# Altium schematic sheet F103-DRV8313.SchDoc
size A3; SheetNumber: 1; SheetTotal: 1
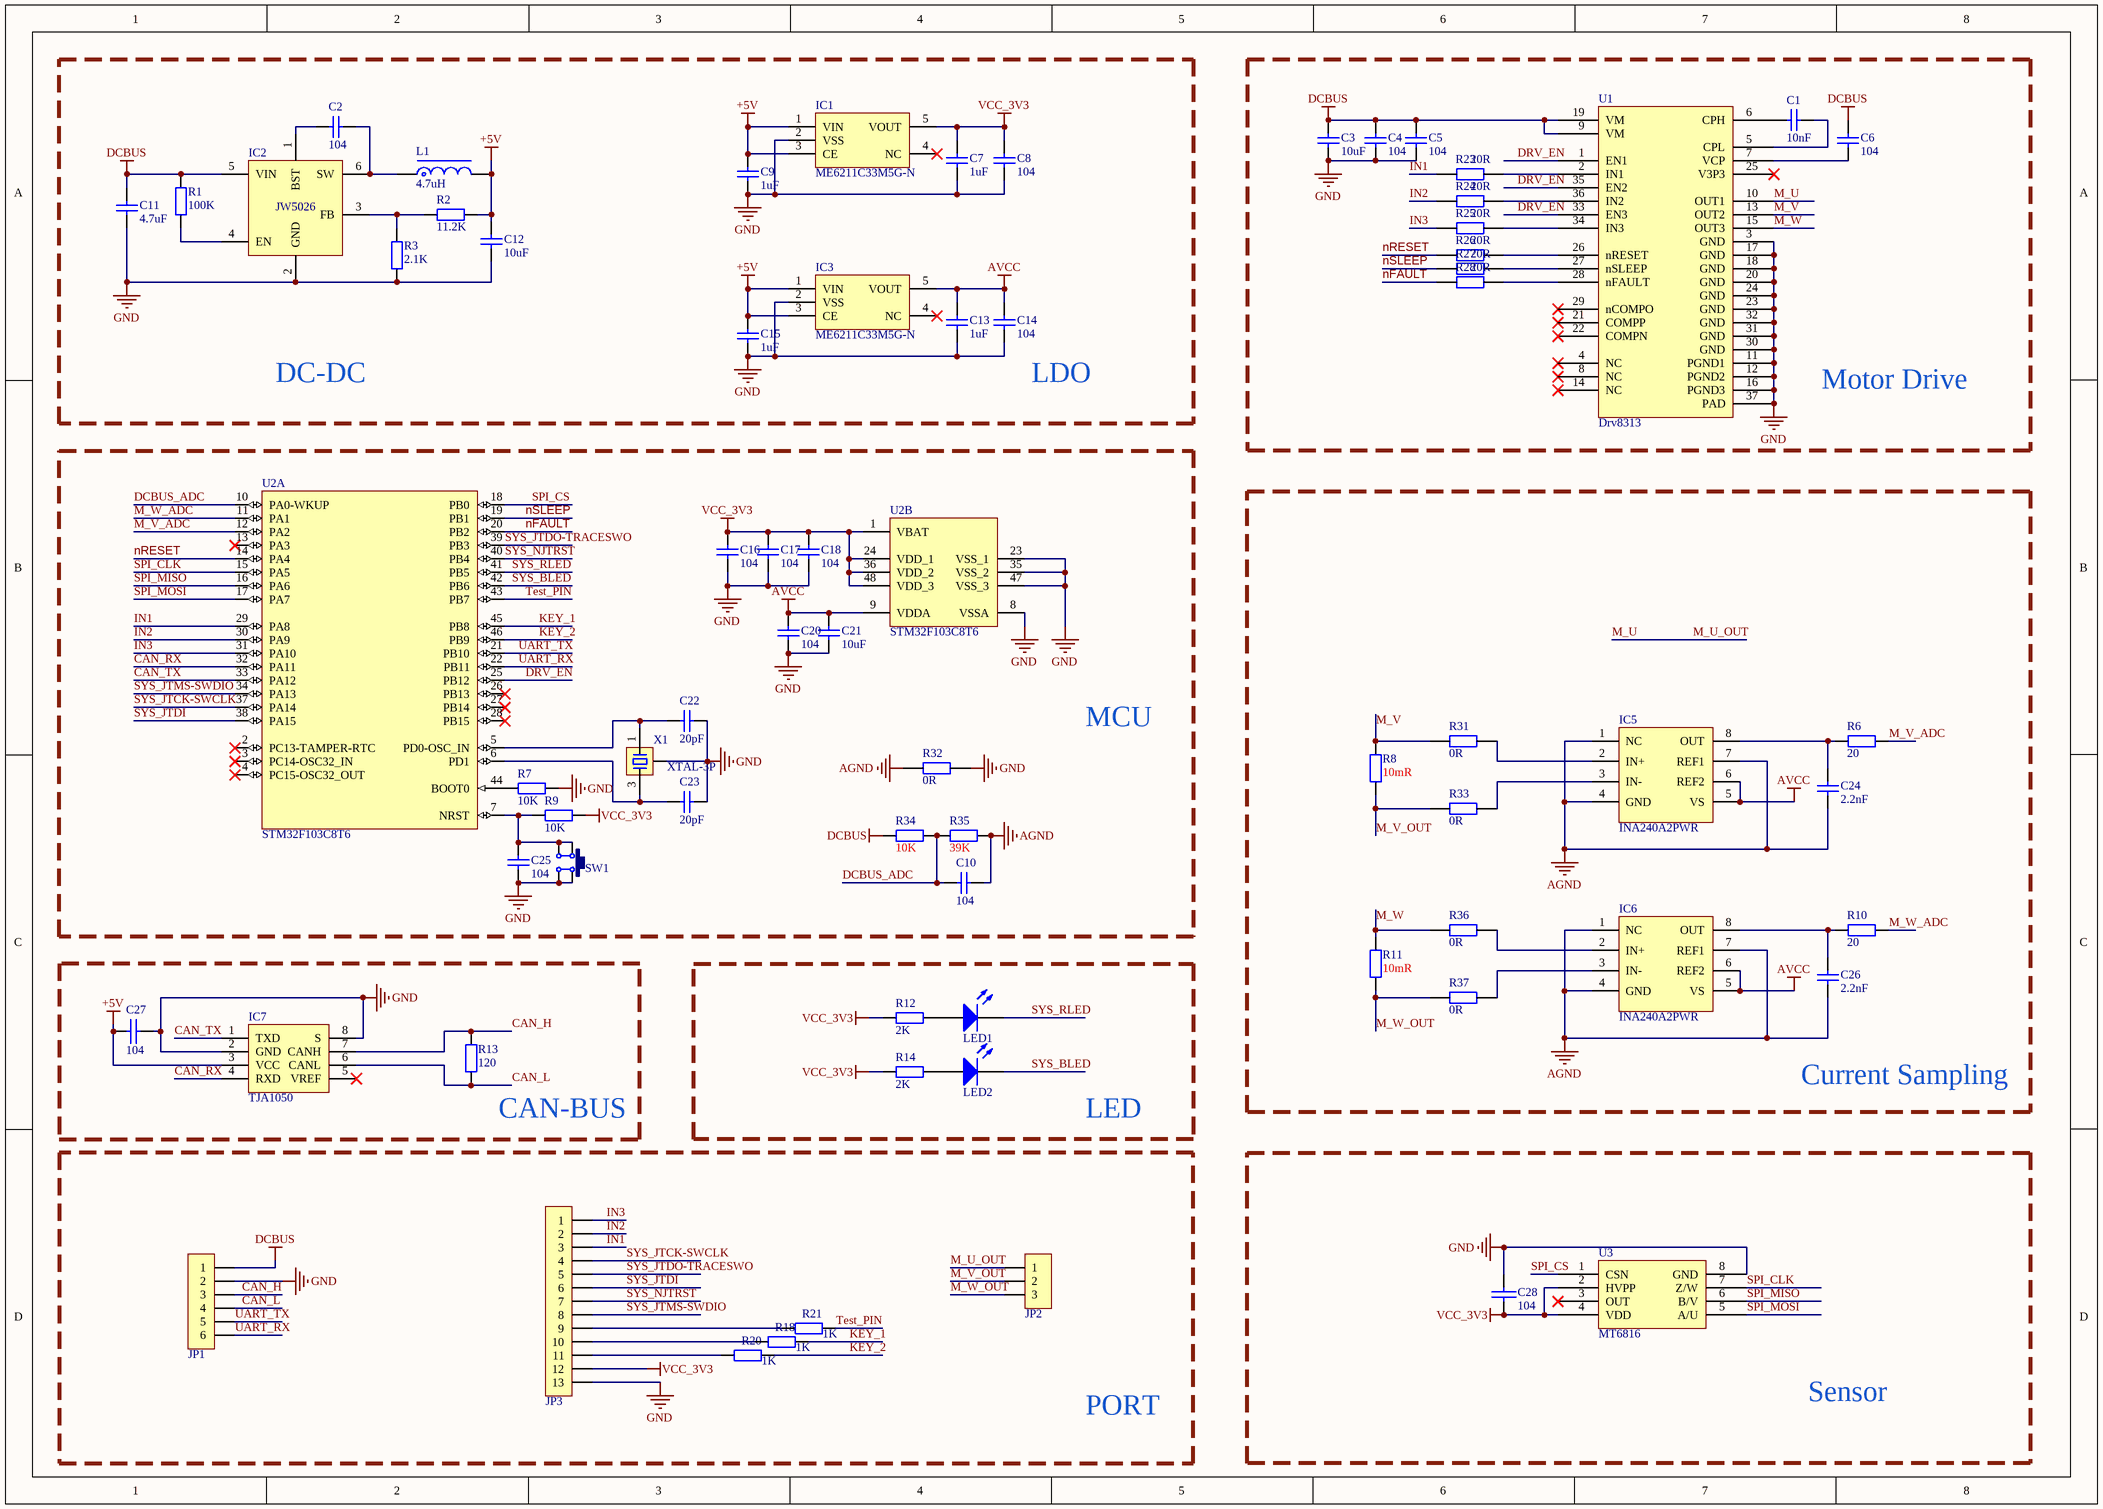
[diagram p0: F103-DRV8313.SchDoc]

## Parts
C1  10nF  [C0603_L]
C2  104  [C0603_L]
C3  10uF  [C0603_L]
C4  104  [C0603_L]
C5  104  [C0603_L]
C6  104  [C0603_L]
C7  1uF  [C0603_L]
C8  104  [C0603_L]
C9  1uF  [C0603_L]
C10  104  [C0402_L]
C11  4.7uF  [C0603_L]
C12  10uF  [C0603_L]
C13  1uF  [C0603_L]
C14  104  [C0603_L]
C15  1uF  [C0603_L]
C16  104  [C0402_L]
C17  104  [C0402_L]
C18  104  [C0402_L]
C20  104  [C0402_L]
C21  10uF  [C0402_L]
C22  20pF  [C0402_L]
C23  20pF  [C0402_L]
C24  2.2nF  [C0402_L]
C25  104  [C0402_L]
C26  2.2nF  [C0402_L]
C27  104  [C0402_L]
C28  104  [C0402_L]
IC1  ME6211C33M5G-N  [SOT23-5N]
IC2  JW5026  [SOT23-6M]
IC3  ME6211C33M5G-N  [SOT23-5N]
IC5  INA240A2PWR  [TSSOP8_N]
IC6  INA240A2PWR  [TSSOP8_N]
IC7  TJA1050  [SOP8_N]
JP1  HDR-1X6  [GH-1.25-6P]  (value not drawn)
JP2  CON-3P  [SH1.0-WT-3P]  (value not drawn)
JP3  HDR-1X13  [FPC0.5-WT-13P]  (value not drawn)
L1  4.7uH  [CD31]
LED1  LED  [LED 0603B]  (value not drawn)
LED2  LED  [LED 0603B]  (value not drawn)
R1  100K  [R 0402_L]
R2  11.2K  [R 0402_L]
R3  2.1K  [R 0402_L]
R6  20  [R 0402_L]
R7  10K  [R0402_L]
R8  10mR  [R0805_L]
R9  10K  [R0402_L]
R10  20  [R 0402_L]
R11  10mR  [R0805_L]
R12  2K  [R 0402_L]
R13  120  [R0402_L]
R14  2K  [R 0402_L]
R18  1K  [R0402_L]
R20  1K  [R0402_L]
R21  1K  [R0402_L]
R23  20R  [R0402_L]
R24  20R  [R0402_L]
R25  20R  [R0402_L]
R26  20R  [R0402_L]
R27  20R  [R0402_L]
R28  20R  [R0402_L]
R31  0R  [R0402_L]
R32  0R  [R0402_L]
R33  0R  [R0402_L]
R34  10K  [R0402_L]
R35  39K  [R0402_L]
R36  0R  [R0402_L]
R37  0R  [R0402_L]
SW1  6x6x5  [TSW SMD-2.9*3.9*2]  (value not drawn)
U1  Drv8313  [VFQFPN36_N]
U2  STM32F103C8T6  [LQFP48_N]  (parts A,B of 2)
U3  MT6816  [SOP8_N]
X1  XTAL-3P  [SMD3213-3P]

## Blocks framed on the sheet
Motor Drive: C1 C3-C6 R23-R28 U1
MCU: C10 C16-C18 C20-C23 C25 R7 R9 R32 R34 R35 SW1 U2 X1
Current Sampling: C24 C26 IC5 IC6 R6 R8 R10 R11 R31 R33 R36 R37
CAN-BUS: C27 IC7 R13
LED: LED1 LED2 R12 R14
PORT: JP1-JP3 R18 R20 R21
Sensor: C28 U3

## Nets
+5V: C9.2 C12.2 C15.2 C27.1 IC1.1(VIN) IC1.3(CE) IC3.1(VIN) IC3.3(CE) IC7.3(VCC) L1.2 R2.1
AGND: C10.1 C24.1 C26.1 IC5.1(NC) IC5.4(GND) IC5.7(REF1) IC6.1(NC) IC6.4(GND) IC6.7(REF1) R32.1 R35.1
AVCC: C13.2 C14.2 C20.2 C21.2 IC3.5(VOUT) IC5.5(VS) IC5.6(REF2) IC6.5(VS) IC6.6(REF2) U2.9(VDDA)
DCBUS: C3.2 C4.2 C5.2 C6.1 C11.2 IC2.5(VIN) JP1.1 R1.2 R34.2 U1.9(VM) U1.19(VM)
GND: C3.1 C4.1 C5.1 C7.1 C8.1 C9.1 C11.1 C12.1 C13.1 C14.1 C15.1 C16.1 C17.1 C18.1 C20.1 C21.1 C22.1 C23.1 C25.1 C27.2 C28.2 IC1.2(VSS) IC2.2(GND) IC3.2(VSS) IC7.2(GND) IC7.8(S) JP1.2 JP3.13 R3.1 R7.2 R32.2 SW1.2 U1.3(GND) U1.11(PGND1) U1.12(PGND2) U1.16(PGND3) U1.17(GND) U1.18(GND) U1.20(GND) U1.23(GND) U1.24(GND) U1.30(GND) U1.31(GND) U1.32(GND) U1.37(PAD) U2.8(VSSA) U2.23(VSS_1) U2.35(VSS_2) U2.47(VSS_3) U3.8(GND) X1.2
VCC_3V3: C7.2 C8.2 C16.2 C17.2 C18.2 C28.1 IC1.5(VOUT) JP3.12 R9.2 R12.1 R14.1 U2.1(VBAT) U2.24(VDD_1) U2.36(VDD_2) U2.48(VDD_3) U3.2(HVPP) U3.4(VDD)
CAN_H: IC7.7(CANH) JP1.3 R13.2
CAN_L: IC7.6(CANL) JP1.4 R13.1
CAN_RX: IC7.4(RXD) U2.32(PA11)
CAN_TX: IC7.1(TXD) U2.33(PA12)
DCBUS_ADC: C10.2 R34.1 R35.2 U2.10(PA0-WKUP)
DRV_EN: U1.1(EN1) U1.33(EN3) U1.35(EN2) U2.25(PB12)
IN1: JP3.3 R23.1 U2.29(PA8)
IN2: JP3.2 R24.1 U2.30(PA9)
IN3: JP3.1 R25.1 U2.31(PA10)
KEY_1: R18.1 U2.45(PB8)
KEY_2: R20.1 U2.46(PB9)
M_U: JP2.1 U1.10(OUT1)  [also labelled M_U_OUT]
M_V: R8.1 R31.1 U1.13(OUT2)
M_V_ADC: R6.1 U2.12(PA2)
M_V_OUT: JP2.2 R8.2 R33.1
M_W: R11.1 R36.1 U1.15(OUT3)
M_W_ADC: R10.1 U2.11(PA1)
M_W_OUT: JP2.3 R11.2 R37.1
nFAULT: R28.1 U2.20(PB2)
nRESET: R26.1 U2.14(PA4)
nSLEEP: R27.1 U2.19(PB1)
SPI_CLK: U2.15(PA5) U3.7(Z/W)
SPI_CS: U2.18(PB0) U3.1(CSN)
SPI_MISO: U2.16(PA6) U3.6(B/V)
SPI_MOSI: U2.17(PA7) U3.5(A/U)
SYS_BLED: LED2.2(K) U2.42(PB6)
SYS_JTCK-SWCLK: JP3.4 U2.37(PA14)
SYS_JTDI: JP3.6 U2.38(PA15)
SYS_JTDO-TRACESWO: JP3.5 U2.39(PB3)
SYS_JTMS-SWDIO: JP3.8 U2.34(PA13)
SYS_NJTRST: JP3.7 U2.40(PB4)
SYS_RLED: LED1.2(K) U2.41(PB5)
Test_PIN: R21.1 U2.43(PB7)
UART_RX: JP1.6 U2.22(PB11)
UART_TX: JP1.5 U2.21(PB10)
NetC1_1: C1.1 U1.5(CPL)
NetC1_2: C1.2 U1.6(CPH)
NetC2_1: C2.1 IC2.1(BST)
NetC2_2: C2.2 IC2.6(SW) L1.1
NetC6_2: C6.2 U1.7(VCP)
NetC22_2: C22.2 U2.5(PD0-OSC_IN) X1.1
NetC23_2: C23.2 U2.6(PD1) X1.3
NetC24_2: C24.2 IC5.8(OUT) R6.2
NetC25_2: C25.2 R9.1 SW1.1 U2.7(NRST)
NetC26_2: C26.2 IC6.8(OUT) R10.2
NetIC2_3: IC2.3(FB) R2.2 R3.2
NetIC2_4: IC2.4(EN) R1.1
NetIC5_2: IC5.2(IN+) R31.2
NetIC5_3: IC5.3(IN-) R33.2
NetIC6_2: IC6.2(IN+) R36.2
NetIC6_3: IC6.3(IN-) R37.2
NetJP3_9: JP3.9 R21.2
NetJP3_10: JP3.10 R18.2
NetJP3_11: JP3.11 R20.2
NetLED1_1: LED1.1(A) R12.2
NetLED2_1: LED2.1(A) R14.2
NetR7_1: R7.1 U2.44(BOOT0)
NetR23_2: R23.2 U1.2(IN1)
NetR24_2: R24.2 U1.36(IN2)
NetR25_2: R25.2 U1.34(IN3)
NetR26_2: R26.2 U1.26(nRESET)
NetR27_2: R27.2 U1.27(nSLEEP)
NetR28_2: R28.2 U1.28(nFAULT)

Not connected (* = marked no-connect by the designer): IC1 4(NC)*; IC3 4(NC)*; IC7 5(VREF)*; U1 4(NC)* 8(NC)* 14(NC)* 21(COMPP)* 22(COMPN)* 25(V3P3)* 29(nCOMPO)*; U2 2(PC13-TAMPER-RTC)* 3(PC14-OSC32_IN)* 4(PC15-OSC32_OUT)* 13(PA3)* 26(PB13)* 27(PB14)* 28(PB15)*; U3 3(OUT)*

## Notes on the sheet
- DC-DC
- (near C14) LDO

## Library data of the parts
C1-C18 C20-C26 = C: 贴片电容/MLCC电容; BOM名称: 无极性贴片电容; 联系卖家，免费查找封装: 唯一出售店铺网址https://shop463601444.taobao.com
C27 C28 = Capacitor: Value: 20pF
IC2 = JW5026 40V 1A
IC5 IC6 = INA240A2PWR: 运放芯片
IC7 = TJA1050: CAN总线收发芯片; BOM名称: CAN总线收发芯片
JP1 = Header 6: 6P连接器; 联系卖家 免费技术支持: 封装库来自淘宝卖家ID：黄晶宝石; BOM名称: 6P连接器
JP2 = Header 3: 3P连接器; 联系卖家 免费查找封装: 唯一出售店铺网址https://shop463601444.taobao.com; 联系卖家 免费技术支持: 封装库来自淘宝卖家ID：黄晶宝石; BOM名称: 3P连接器
JP3 = Header 13: 13P连接器; 联系卖家 免费技术支持: 封装库来自淘宝卖家ID：黄晶宝石; BOM名称: 13P连接器
L1 = L-CDRH: 功率屏蔽电感; BOM名称: 功率屏蔽电感
LED1 LED2 = LED: 发光二极管
R1-R3 R6 R10 R12-R14 R18 R20 R21 = R: 贴片电阻; BOM名称: 贴片电阻
R7 R9 R34 R35 = R: 贴片电阻; 联系卖家，免费查找封装: 唯一出售店铺网址https://shop463601444.taobao.com; BOM名称: 贴片电阻
R8 R11 = R-I: 电流检测电阻; BOM名称: 电流检测电阻
R23-R28 R31-R33 R36 R37 = RES_R: 10K
SW1 = TSW SMD-6x6: 贴片6x6轻触开关; BOM名称: 贴片6x6轻触开关
U2 = STM32F103C8T6: STM32 ARM-based 32-bit MCU Performance Line with 64 kB Flash, 20 kB Internal RAM, -40 to +85癈 Temperature, 48-Pin LQFP, Tray; 联系卖家，免费查找封装: 唯一出售店铺网址https://shop463601444.taobao.com; DatasheetVersion: rev13.0, Apr-2011; PackageVersion: rev13, Apr-2011; PackageReference: LQFP48; PackageDescription: 48-Pin Low-Profile Quad Flat Pack, 7 x 7 mm Body, 0.5 mm Pitch (LQFP48); ComponentLink1Description: Manufacturer URL; ComponentLink1URL: http://www.st.com/; ComponentLink2Description: STM32F103 Datasheet; ComponentLink2URL: http://www.st.com/internet/com/TECHNICAL_RESOURCES/TECHNICAL_LITERATURE/DATASHEET/CD00161566.pdf; ComponentLink3Description: STM32 Family Web Page; ComponentLink3URL: www.st.com/stm32
X1 = XTAL-3P: 三脚无源晶振